# Altium schematic sheet MDB.SchDoc: MDB
size A4; Date: 30 08 2013; Author: Rachid AKKOUCHE; CompanyName: RASoftware; DrawnBy: Rachid AKKOUCHE; Organization: RASoftware; Address1: 52 J03, rue de la crèche; Address2: 77100 MEAUX; Address3: FRANCE; DocumentNumber: BRA201308303C; Revision: C; SheetNumber: 3; SheetTotal: 11; Telephone: +33651604047; Email: rachid.akkouche@wanadoo.fr; Proprietaire: MDI System; Dessinepar: -; Verifiepar: -; Time: 19:00
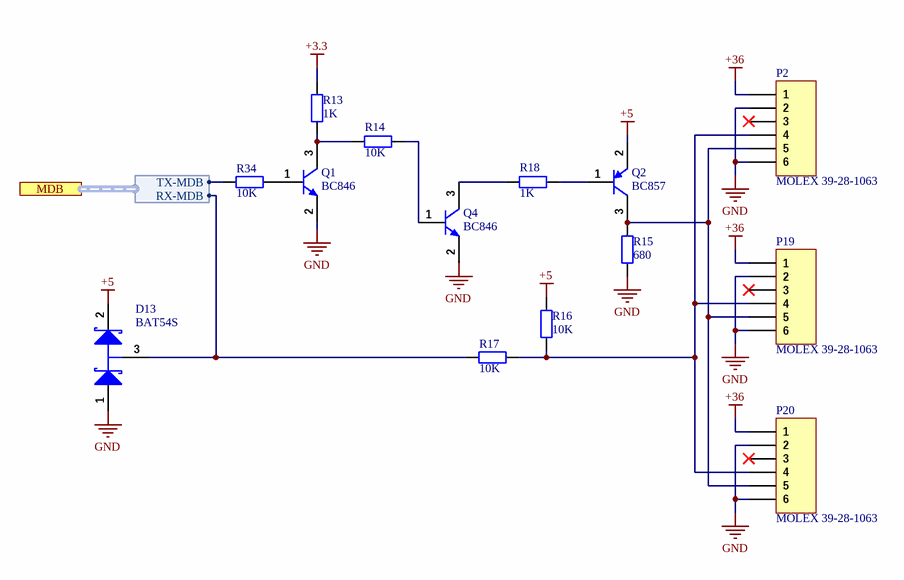
[diagram p0: MDB.SchDoc]

## Parts
D13  BAT54S  [SOT23]
P2  MOLEX 39-28-1063  [MOLEX 39-28-1063]
P19  MOLEX 39-28-1063  [MOLEX 39-28-1063]
P20  MOLEX 39-28-1063  [MOLEX 39-28-1063]
Q1  BC846  [SOT-23]
Q2  BC857  [SOT-23]
Q4  BC846  [SOT-23]
R13  1K  [R0805]
R14  10K  [R0805]
R15  680  [R0805]
R16  10K  [R0805]
R17  10K  [R0805]
R18  1K  [R0805]
R34  10K  [R0805]

## Ports
MDB (harness MDB)

## Harnesses
MDB: TX-MDB, RX-MDB

## Nets
+3.3: R13.2
+5: D13.2(K) Q2.2(E) R16.2
+36: P2.1 P19.1 P20.1
GND: D13.1(A) P2.2 P2.6 P19.2 P19.6 P20.2 P20.6 Q1.2(E) Q4.2(E) R15.1
NetD13_3: D13.3(C) R17.2 ; port MDB.RX-MDB
NetP2_4: P2.4 P19.4 P20.4 R16.1 R17.1
NetP2_5: P2.5 P19.5 P20.5 Q2.3(C) R15.2
NetQ1_1: Q1.1(B) R34.1
NetQ1_3: Q1.3(C) R13.1 R14.2
NetQ2_1: Q2.1(B) R18.1
NetQ4_1: Q4.1(B) R14.1
NetQ4_3: Q4.3(C) R18.2
NetR34_2: R34.2 ; port MDB.TX-MDB

Not connected (* = marked no-connect by the designer): P2 3*; P19 3*; P20 3*

## Notes on the sheet
- Ce document est la propriété de
- Project:
- Il ne peut être divulgué sans l'accord écrit de l'un de ses représentants dûment mandaté
- Title:
- Number:
- Date:
- Time:
- Size:
- A4
- Revision:
- Sheet
- of
- 52 J03 rue de la crèche
- Draw by:
- 77100 Meaux

## Library data of the parts
D13 = BAT54S: Schottky Barrier Double Diode; Manufacturer: MULTICOMP; Courant, If moy.: 200; Tension, Vrrm: 30; Tension, Vf max..: 400; Temps trr max.: 5; Courant, Ifs max.: 600; Type de boîtier diode: SOT-23; Nombre de broches: 3; SVHC: No SVHC (19-Dec-2012); Configuration diode: Dual Series; Température, Tj max..: 150; Type de terminaison: SMD; Température d'utilisation min: -55; Courant, If, Vf: 10; Courant, Ir, max..: 2; Marquage, CMS: L44; Température de fonctionnement: -55°C à +150; Supplier 1: Farnell; Supplier Part Number 1: 1621835; Manufacturer Part Number: BAT54S; RoHS: YES; Stock 1: 52055; Pricing 1: 10=0,102, 250=0,074, 1000=0,06, 3000=0,053 (EUR); Diode Type: Schottky; Type de boîtier: SOT-23; courant Ifsm: 600; ComponentLink1URL: http://www.farnell.com/datasheets/1317753.pdf; ComponentLink1Description: http://www.farnell.com/datasheets/1317753.pdf; Température de fonctionnement max..: 150
P2 P19 P20 = Header 6: Connecteur MDB; Supplier 1: Farnell; Supplier Part Number 1: 9732101; Manufacturer: MOLEX; Manufacturer Part Number: 39-28-1063; RoHS: YES; Pricing 1: 1=0,66, 100=0,62, 250=0,58, 500=0,52, 1000=0,46 (EUR); ComponentLink1URL: http://www.molex.com/pdm_docs/sd/039310028_sd.pdf; ComponentLink1Description: http://www.molex.com/pdm_docs/sd/039310028_sd.pdf; ComponentLink2URL: http://www.youtube.com/watch?v=pjOsgpqyzYE; ComponentLink2Description: http://www.youtube.com/watch?v=pjOsgpqyzYE; ComponentLink3URL: http://www.farnell.com/datasheets/1729684.pdf; ComponentLink3Description: http://www.farnell.com/datasheets/1729684.pdf
Q1 Q4 = BC846B: NPN General-purpose Transistor; Manufacturer: NXP; Tension, Vceo: 65; Dissipation de puissance Pd: 250; Courant de collecteur DC: 100; Gain en courant DC hFE: 110; Température d'utilisation min: -65; Température de fonctionnement max..: 150; Nombre de broches: 3; SVHC: No SVHC (19-Dec-2012); Courant, Ic (hfe): 2; FB max..: 10; Gain Bande-passante ft, typ.: 300; Hfe, typ.: 125; Marquage, CMS: 1; Température de fonctionnement: -65°C à +150; Tension, Vcbo: 80; Tension, Vce sat max..: 200; Type de terminaison: SMD; Supplier 1: Farnell; Supplier Part Number 1: 1081227; Manufacturer Part Number: BC846; RoHS: YES; Pricing 1: 10=0,02, 100=0,016, 1000=0,015, 3000=0,013 (EUR); Polarité transistor: NPN; Type de boîtier de transistor: SOT-23; Courant Ic max..: 100; Courant, Ic max.. permanent a: 100; Hfe, min.: 110; Marquage composant: BC846; Nombre de transistors: 1; Puissance, Ptot: 250; Type de boîtier: SOT-23; ft, min.: 100; ComponentLink1URL: http://www.farnell.com/datasheets/1581369.pdf; ComponentLink1Description: http://www.farnell.com/datasheets/1581369.pdf
Q2 = PMBT2907A: PNP Switching Transistor; Manufacturer: NXP; Supplier 1: Farnell; Supplier Part Number 1: 1081244; Manufacturer Part Number: BC857; RoHS: YES; Stock 1: 28017; Pricing 1: 10=0,023, 100=0,021, 1000=0,019, 3000=0,017 (EUR); ComponentLink1URL: http://www.nxp.com/documents/data_sheet/BC856_BC857_BC858.pdf; ComponentLink1Description: http://www.nxp.com/documents/data_sheet/BC856_BC857_BC858.pdf
R13 R18 = Resistor 0805 1K: Resistor; Manufacturer: MULTICOMP; Manufacturer Part Number: MC0.1W08051%1KFR; Product Range: MULTICOMP - MC Series; Résistance: 1; Puissance: 100; Tolérance de résistance: ± 1%; Type de boîtier de résistance: 0805; Type de résistance: Couche épaisse; Coefficient de température: ± 100; Tension: 150; Type de packaging: Full Reel; Resistor Mounting: CMS; Supplier 1: Farnell; RoHS: YES; Pricing 1: 5000=0,001 (EUR); MSL: MSL 1 - Illimité; ComponentLink1URL: http://www.farnell.com/datasheets/1716700.pdf; ComponentLink1Description: http://www.farnell.com/datasheets/1716700.pdf; Supplier Part Number 1: 2129113
R14 R17 R34 = Resistor 0805 10K: Resistor; Manufacturer: MULTICOMP; Manufacturer Part Number: MC0.1W08051%10KFR; Product Range: MULTICOMP - MC Series; Résistance: 10; Puissance: 100; Tolérance de résistance: ± 1%; Type de boîtier de résistance: 0805; Type de résistance: Couche épaisse; Coefficient de température: ± 100; Tension: 150; Type de packaging: Full Reel; Resistor Mounting: CMS; Supplier 1: Farnell; RoHS: YES; Pricing 1: 5000=0,001 (EUR); MSL: MSL 1 - Illimité; ComponentLink1URL: http://www.farnell.com/datasheets/1716700.pdf; ComponentLink1Description: http://www.farnell.com/datasheets/1716700.pdf; Supplier Part Number 1: 2129195
R15 = Resistor 0805 680: Resistor; Manufacturer: MULTICOMP; Manufacturer Part Number: MC01W08051680R; Supplier 1: Farnell; RoHS: YES; Pricing 1: 5000=0,001 (EUR); ComponentLink1URL: http://www.farnell.com/datasheets/1729047.pdf; ComponentLink1Description: http://www.farnell.com/datasheets/1729047.pdf; Supplier Part Number 1: 2129101
R16 = Resistor 0805 390: Resistor; Manufacturer: MULTICOMP; Manufacturer Part Number: MC01W0805110K; Gamme de produit: Série MC; Résistance: 10; Puissance: 100; Tolérance de résistance: ± 1%; Tension: 150; Type de boîtier de résistance: 0805 [2012 Metric]; Type de packaging: Bande et Bobine; Type de résistance: Couche épaisse; Coefficient de température: ± 100; SVHC: No SVHC (17-Dec-2014); Montage de résistance: CMS; Quantité par bobine: 5000; Supplier 1: Farnell; Supplier Part Number 1: 2129195; RoHS: YES; Stock 1: 3894995; Pricing 1: 5000=0,0008 (EUR); MSL: -; ComponentLink1URL: http://www.farnell.com/datasheets/1729047.pdf; ComponentLink1Description: http://www.farnell.com/datasheets/1729047.pdf